# Altium schematic sheet MAIN.SchDoc
size A; SheetNumber: 1; SheetTotal: 10
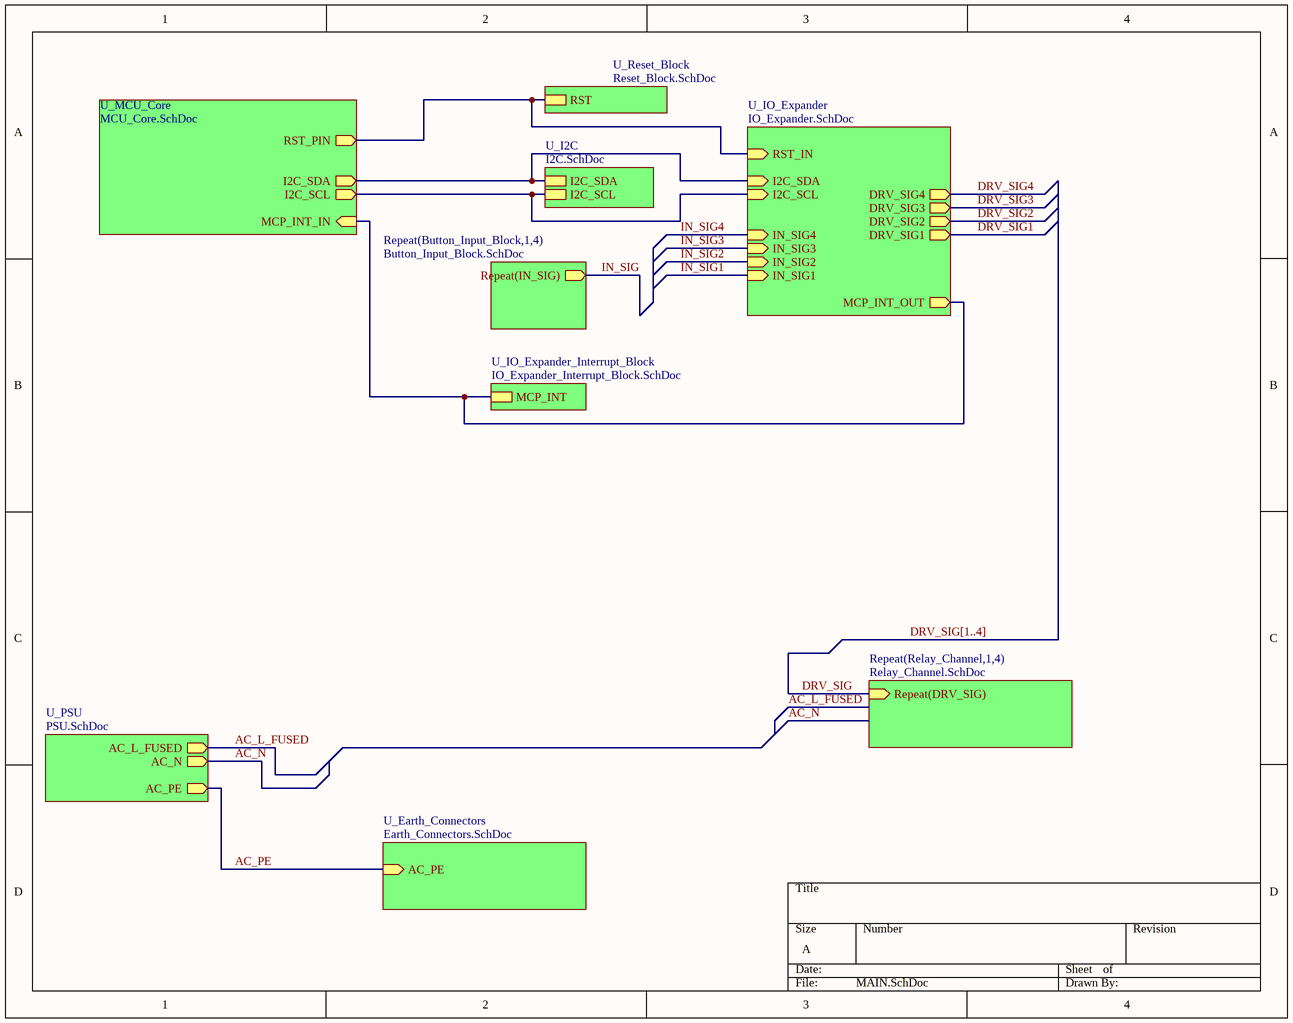
[diagram p0: MAIN.SchDoc]

## Sub-sheets
Repeat(Button_Input_Block,1,4) = Button_Input_Block.SchDoc: Repeat(IN_SIG) (out)
Repeat(Relay_Channel,1,4) = Relay_Channel.SchDoc: Repeat(DRV_SIG) (in)
U_Earth_Connectors = Earth_Connectors.SchDoc: AC_PE (in)
U_I2C = I2C.SchDoc: I2C_SCL, I2C_SDA
U_IO_Expander = IO_Expander.SchDoc: I2C_SDA (in), I2C_SCL (in), RST_IN (in), IN_SIG4 (in), IN_SIG3 (in), IN_SIG1 (in), IN_SIG2 (in), DRV_SIG4 (out), DRV_SIG1 (out), DRV_SIG3 (out), DRV_SIG2 (out), MCP_INT_OUT (out)
U_IO_Expander_Interrupt_Block = IO_Expander_Interrupt_Block.SchDoc: MCP_INT
U_MCU_Core = MCU_Core.SchDoc: I2C_SCL (out), RST_PIN (out), I2C_SDA (out), MCP_INT_IN (in)
U_PSU = PSU.SchDoc: AC_N (out), AC_L_FUSED (out), AC_PE (out)
U_Reset_Block = Reset_Block.SchDoc: RST

## Nets
AC_L_FUSED: sheet U_PSU/AC_L_FUSED
AC_N: sheet U_PSU/AC_N
AC_PE: sheet U_PSU/AC_PE, sheet U_Earth_Connectors/AC_PE
DRV_SIG: sheet Repeat(Relay_Channel,1,4)/Repeat(DRV_SIG)
DRV_SIG1: sheet U_IO_Expander/DRV_SIG1
DRV_SIG2: sheet U_IO_Expander/DRV_SIG2
DRV_SIG3: sheet U_IO_Expander/DRV_SIG3
DRV_SIG4: sheet U_IO_Expander/DRV_SIG4
IN_SIG: sheet Repeat(Button_Input_Block,1,4)/Repeat(IN_SIG)
IN_SIG1: sheet U_IO_Expander/IN_SIG1
IN_SIG2: sheet U_IO_Expander/IN_SIG2
IN_SIG3: sheet U_IO_Expander/IN_SIG3
IN_SIG4: sheet U_IO_Expander/IN_SIG4
(unnamed): sheet U_IO_Expander/I2C_SDA, sheet U_I2C/I2C_SDA, sheet U_MCU_Core/I2C_SDA
(unnamed): sheet U_IO_Expander/I2C_SCL, sheet U_I2C/I2C_SCL, sheet U_MCU_Core/I2C_SCL
(unnamed): sheet U_IO_Expander/RST_IN, sheet U_Reset_Block/RST, sheet U_MCU_Core/RST_PIN
(unnamed): sheet U_IO_Expander/MCP_INT_OUT, sheet U_MCU_Core/MCP_INT_IN, sheet U_IO_Expander_Interrupt_Block/MCP_INT

## Buses and harness runs
bus DRV_SIG[1..4]